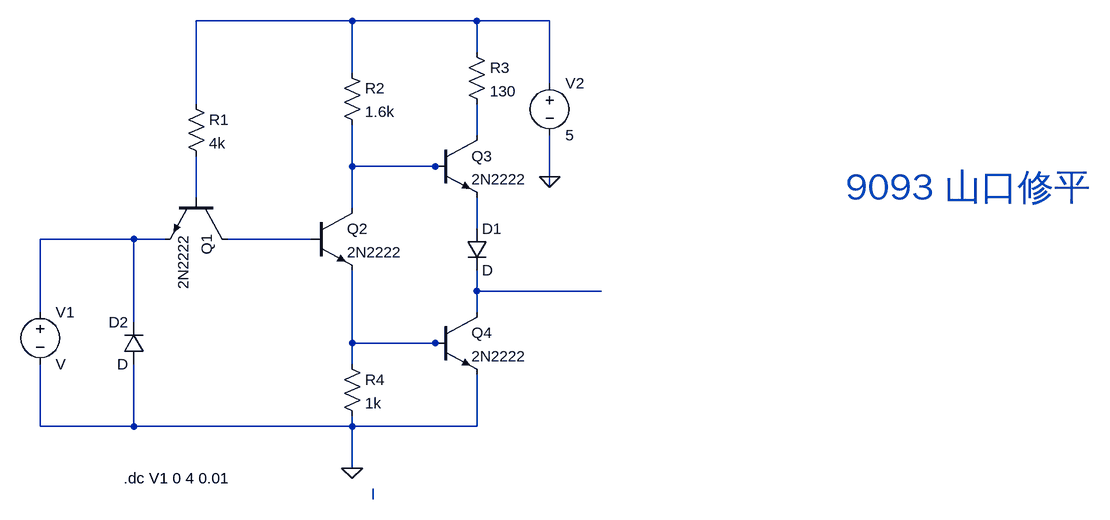
[diagram p0: schematic Draft10.asc]
Draft10.asc, the LTspice schematic file:
Version 4
SHEET 1 1796 724
WIRE 672 -16 432 -16
WIRE 864 -16 672 -16
WIRE 976 -16 864 -16
WIRE 864 32 864 -16
WIRE 672 64 672 -16
WIRE 976 80 976 -16
WIRE 432 112 432 -16
WIRE 864 160 864 112
WIRE 672 208 672 144
WIRE 800 208 672 208
WIRE 816 208 800 208
WIRE 976 224 976 160
WIRE 976 240 976 224
WIRE 432 256 432 192
WIRE 672 272 672 208
WIRE 864 304 864 256
WIRE 336 320 192 320
WIRE 384 320 336 320
WIRE 608 320 480 320
WIRE 864 400 864 368
WIRE 1056 400 864 400
WIRE 192 432 192 320
WIRE 864 432 864 400
WIRE 336 448 336 320
WIRE 672 480 672 368
WIRE 800 480 672 480
WIRE 816 480 800 480
WIRE 816 496 816 480
WIRE 672 512 672 480
WIRE 192 608 192 512
WIRE 336 608 336 512
WIRE 336 608 192 608
WIRE 672 608 672 592
WIRE 672 608 336 608
WIRE 864 608 864 528
WIRE 864 608 672 608
WIRE 672 672 672 608
WIRE 704 720 704 704
FLAG 672 672 0
FLAG 976 224 0
SYMBOL npn 480 256 R90
SYMATTR InstName Q1
SYMATTR Value 2N2222
SYMBOL npn 608 272 R0
SYMATTR InstName Q2
SYMATTR Value 2N2222
SYMBOL npn 800 160 R0
SYMATTR InstName Q3
SYMATTR Value 2N2222
SYMBOL npn 800 432 R0
SYMATTR InstName Q4
SYMATTR Value 2N2222
SYMBOL voltage 192 416 R0
SYMATTR InstName V1
SYMBOL voltage 976 64 R0
SYMATTR InstName V2
SYMATTR Value 5
SYMBOL res 416 96 R0
SYMATTR InstName R1
SYMATTR Value 4k
SYMBOL res 656 48 R0
SYMATTR InstName R2
SYMATTR Value 1.6k
SYMBOL res 848 16 R0
SYMATTR InstName R3
SYMATTR Value 130
SYMBOL res 656 496 R0
SYMATTR InstName R4
SYMATTR Value 1k
SYMBOL diode 848 304 R0
SYMATTR InstName D1
SYMBOL diode 352 512 R180
WINDOW 0 24 64 Left 2
WINDOW 3 24 0 Left 2
SYMATTR InstName D2
TEXT 320 688 Left 2 !.dc V1 0 4 0.01
TEXT 1432 240 Left 5 ;9093 山口修平

The netlist it stands for:
* Draft10.asc
Q1 N007 N004 N006 0 2N2222
Q2 N003 N007 N009 0 2N2222
Q3 N002 N003 N005 0 2N2222
Q4 N008 N009 0 0 2N2222
V1 N006 0 V
V2 N001 0 5
R1 N001 N004 4k
R2 N001 N003 1.6k
R3 N001 N002 130
R4 N009 0 1k
D1 N005 N008 D
D2 0 N006 D
.model D D
.lib standard.dio
.model NPN NPN
.model PNP PNP
.lib standard.bjt
.dc V1 0 4 0.01
* 9093 山口修平
.backanno
.end